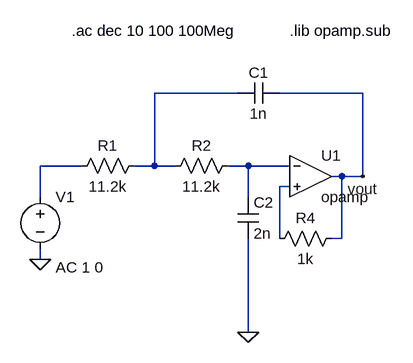
[diagram p0: schematic sallen_key.asc]
sallen_key.asc, the LTspice schematic file:
Version 4
SHEET 1 880 680
WIRE 80 16 -48 16
WIRE 272 16 144 16
WIRE -160 128 -224 128
WIRE -48 128 -48 16
WIRE -48 128 -80 128
WIRE -16 128 -48 128
WIRE 96 128 64 128
WIRE 160 128 96 128
WIRE 240 144 224 144
WIRE 272 144 272 16
WIRE 272 144 240 144
WIRE 160 160 144 160
WIRE -224 176 -224 128
WIRE 96 176 96 128
WIRE 144 240 144 160
WIRE 240 240 240 144
WIRE 240 240 224 240
WIRE -224 272 -224 256
WIRE 96 384 96 240
FLAG 96 384 0
FLAG -224 272 0
FLAG 272 144 vout
SYMBOL Opamps\\opamp 192 80 R0
SYMATTR InstName U1
SYMATTR SpiceLine2 GBW=1Meg
SYMBOL cap 80 176 R0
SYMATTR InstName C2
SYMATTR Value 2n
SYMBOL cap 144 0 R90
WINDOW 0 0 32 VBottom 2
WINDOW 3 32 32 VTop 2
SYMATTR InstName C1
SYMATTR Value 1n
SYMBOL res 80 112 R90
WINDOW 0 0 56 VBottom 2
WINDOW 3 32 56 VTop 2
SYMATTR InstName R2
SYMATTR Value 11.2k
SYMBOL res -64 112 R90
WINDOW 0 0 56 VBottom 2
WINDOW 3 32 56 VTop 2
SYMATTR InstName R1
SYMATTR Value 11.2k
SYMBOL res 240 224 R90
WINDOW 0 0 56 VBottom 2
WINDOW 3 32 56 VTop 2
SYMATTR InstName R4
SYMATTR Value 1k
SYMBOL voltage -224 160 R0
WINDOW 123 24 124 Left 2
WINDOW 39 0 0 Left 0
SYMATTR InstName V1
SYMATTR Value ""
SYMATTR Value2 AC 1 0
TEXT -176 -80 Left 2 !.ac dec 10 100 100Meg
TEXT 160 -80 Left 2 !.lib opamp.sub

The netlist it stands for:
* sallen_key.asc
XU1 N003 N004 vout opamp Aol=100K GBW=1Meg  ; pins invin noninvin out
C2 N003 0 2n
C1 vout N001 1n
R2 N003 N001 11.2k
R1 N001 N002 11.2k
R4 vout N004 1k
V1 N002 0 AC 1 0
.ac dec 10 100 100Meg
.lib opamp.sub
.backanno
.end